# EAGLE design mainboard (EAGLE 5.07)

## Sheet 1 of 3
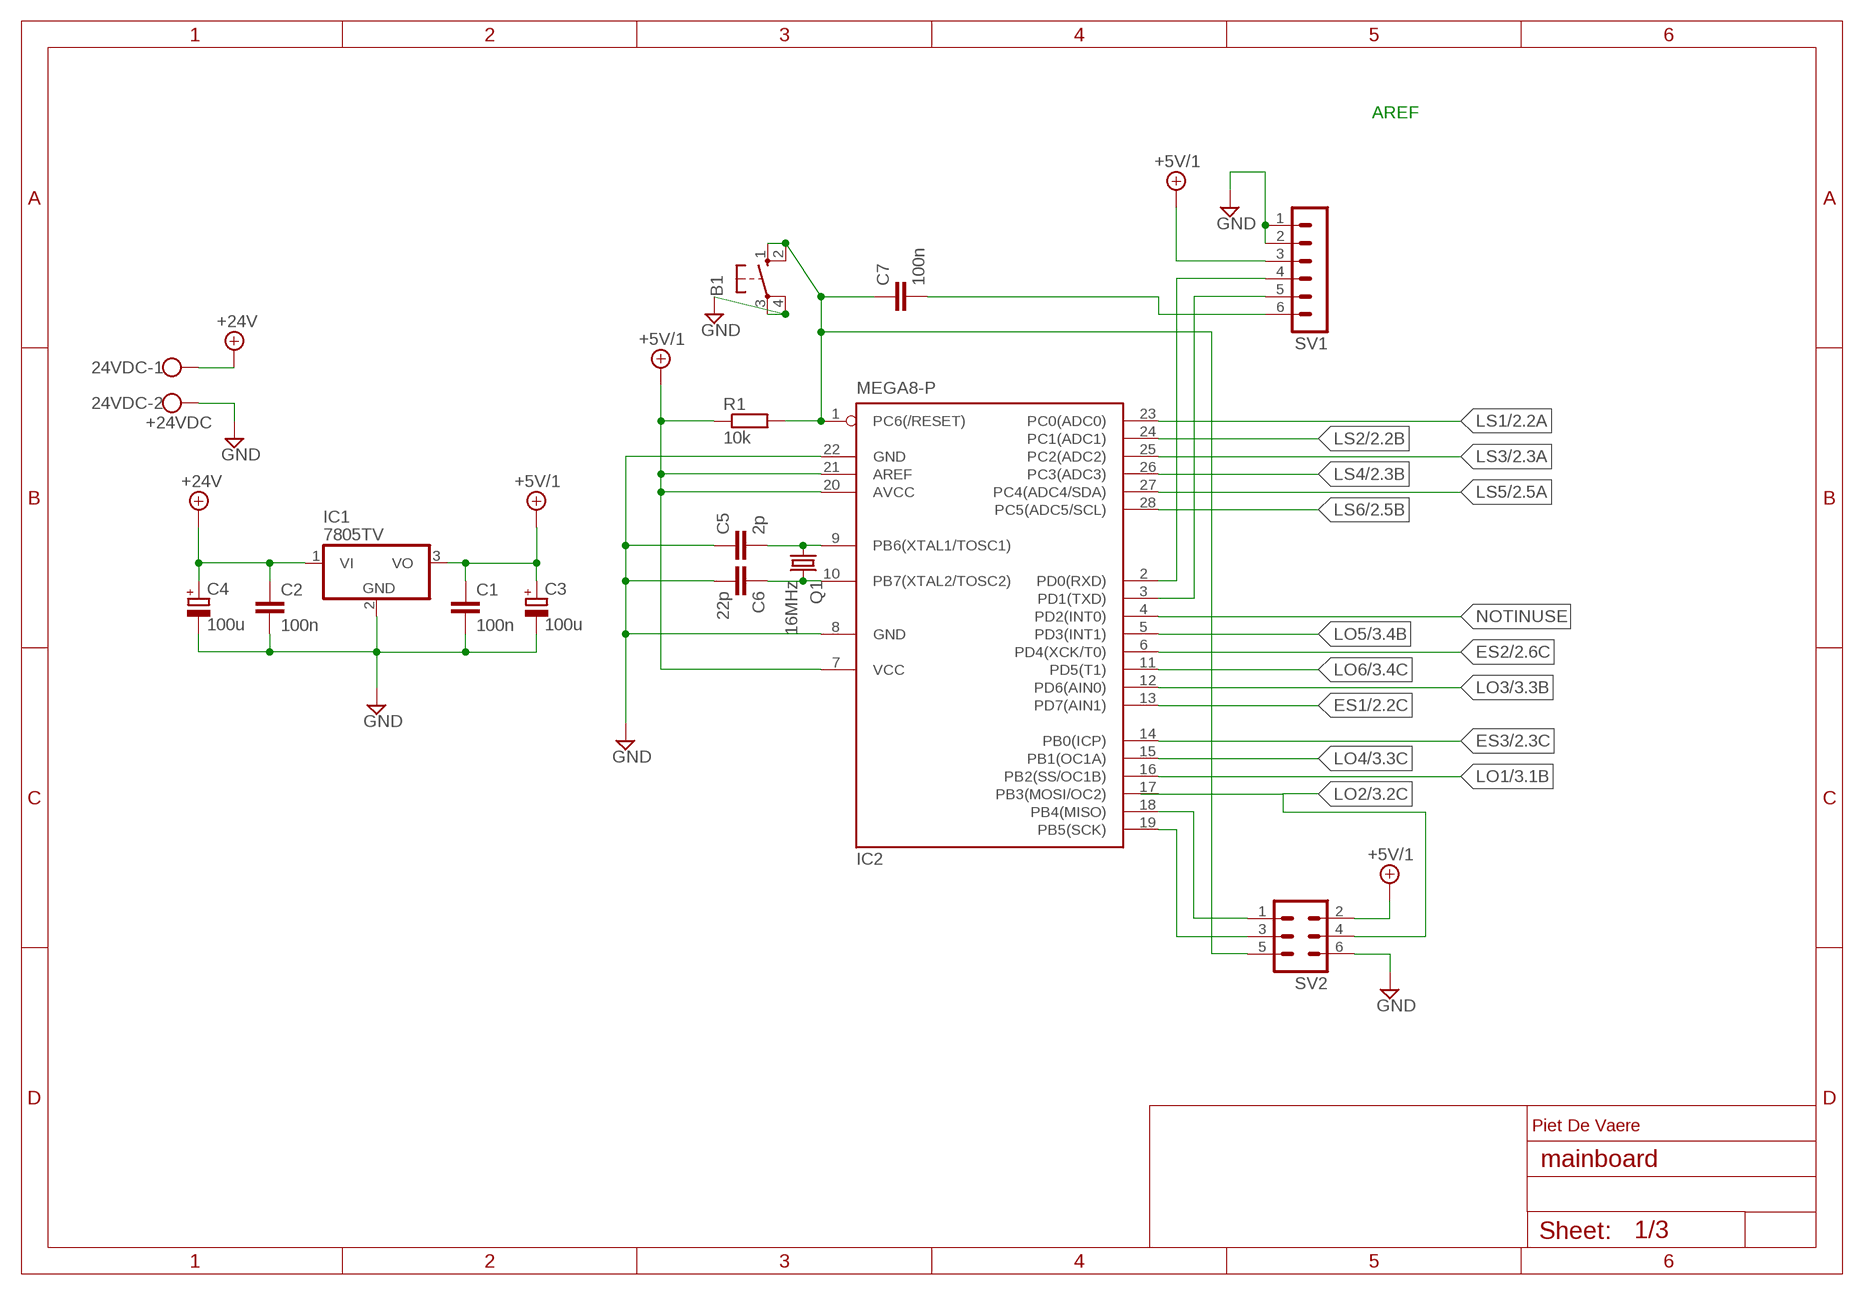
[diagram p0: schematic, sheet 1]

### Parts
24VDC  +24VDC  W237-02P  [W237-132]
B1  10-XX  [B3F-10XX]
C1  100n  C-EU025-030X050  [C025-030X050]
C2  100n  C-EU025-030X050  [C025-030X050]
C3  100u  CPOL-EUE3.5-8  [E3,5-8]
C4  100u  CPOL-EUE3.5-8  [E3,5-8]
C5  2p  C-EU025-030X050  [C025-030X050]
C6  22p  C-EU025-030X050  [C025-030X050]
C7  100n  C-EU025-030X050  [C025-030X050]
IC1  7805TV  [TO220V]
IC2  MEGA8-P  [DIL28-3]
Q1  16MHz  CRYSTALHC49S  [HC49/S]
R1  10k  R-EU_0207/10  [0207/10]
SV1  MA06-1  [MA06-1]
SV2  MA03-2  [MA03-2]

### Nets
+5V/1: C1.1 C3.+ IC1.3(VO) IC2.7(VCC) IC2.20(AVCC) IC2.21(AREF) R1.1 SV1.3 SV2.2 ; also sheet 2
+24V: 24VDC.1 C2.1 C4.+ IC1.1(VI)
ES1: IC2.13(PD7(AIN1)) ; also sheet 2
ES2: IC2.6(PD4(XCK/T0)) ; also sheet 2
ES3: IC2.14(PB0(ICP)) ; also sheet 2
GND [HP]: 24VDC.2 B1.3(P) B1.4(P1) C1.2 C2.2 C3.- C4.- C5.1 C6.2 IC1.2(GND) IC2.8(GND) IC2.22(GND) SV1.1 SV1.2 SV2.6 ; also sheet 2,3
LO1: IC2.16(PB2(SS/OC1B)) ; also sheet 3
LO2: SV2.4 ; also sheet 3
LO3: IC2.12(PD6(AIN0)) ; also sheet 3
LO4: IC2.15(PB1(OC1A)) ; also sheet 3
LO5: IC2.5(PD3(INT1)) ; also sheet 3
LO6: IC2.11(PD5(T1)) ; also sheet 3
LS1: IC2.23(PC0(ADC0)) ; also sheet 2
LS2: IC2.24(PC1(ADC1)) ; also sheet 2
LS3: IC2.25(PC2(ADC2)) ; also sheet 2
LS4: IC2.26(PC3(ADC3)) ; also sheet 2
LS5: IC2.27(PC4(ADC4/SDA)) ; also sheet 2
LS6: IC2.28(PC5(ADC5/SCL)) ; also sheet 2
N$2: C6.1 IC2.10(PB7(XTAL2/TOSC2)) Q1.2
N$3: C5.2 IC2.9(PB6(XTAL1/TOSC1)) Q1.1
N$4: IC2.19(PB5(SCK)) SV2.3
N$5: IC2.18(PB4(MISO)) SV2.1
N$6: IC2.2(PD0(RXD)) SV1.4
N$7: IC2.3(PD1(TXD)) SV1.5
N$8: C7.2 SV1.6
NOTINUSE: IC2.4(PD2(INT0))
RESET: B1.1(S) B1.2(S1) C7.1 IC2.1(PC6(/RESET)) R1.2 SV2.5
Unconnected: IC2.17(PB3(MOSI/OC2))

### Notes on the sheet
- AREF
- Piet De Vaere

## Sheet 2 of 3
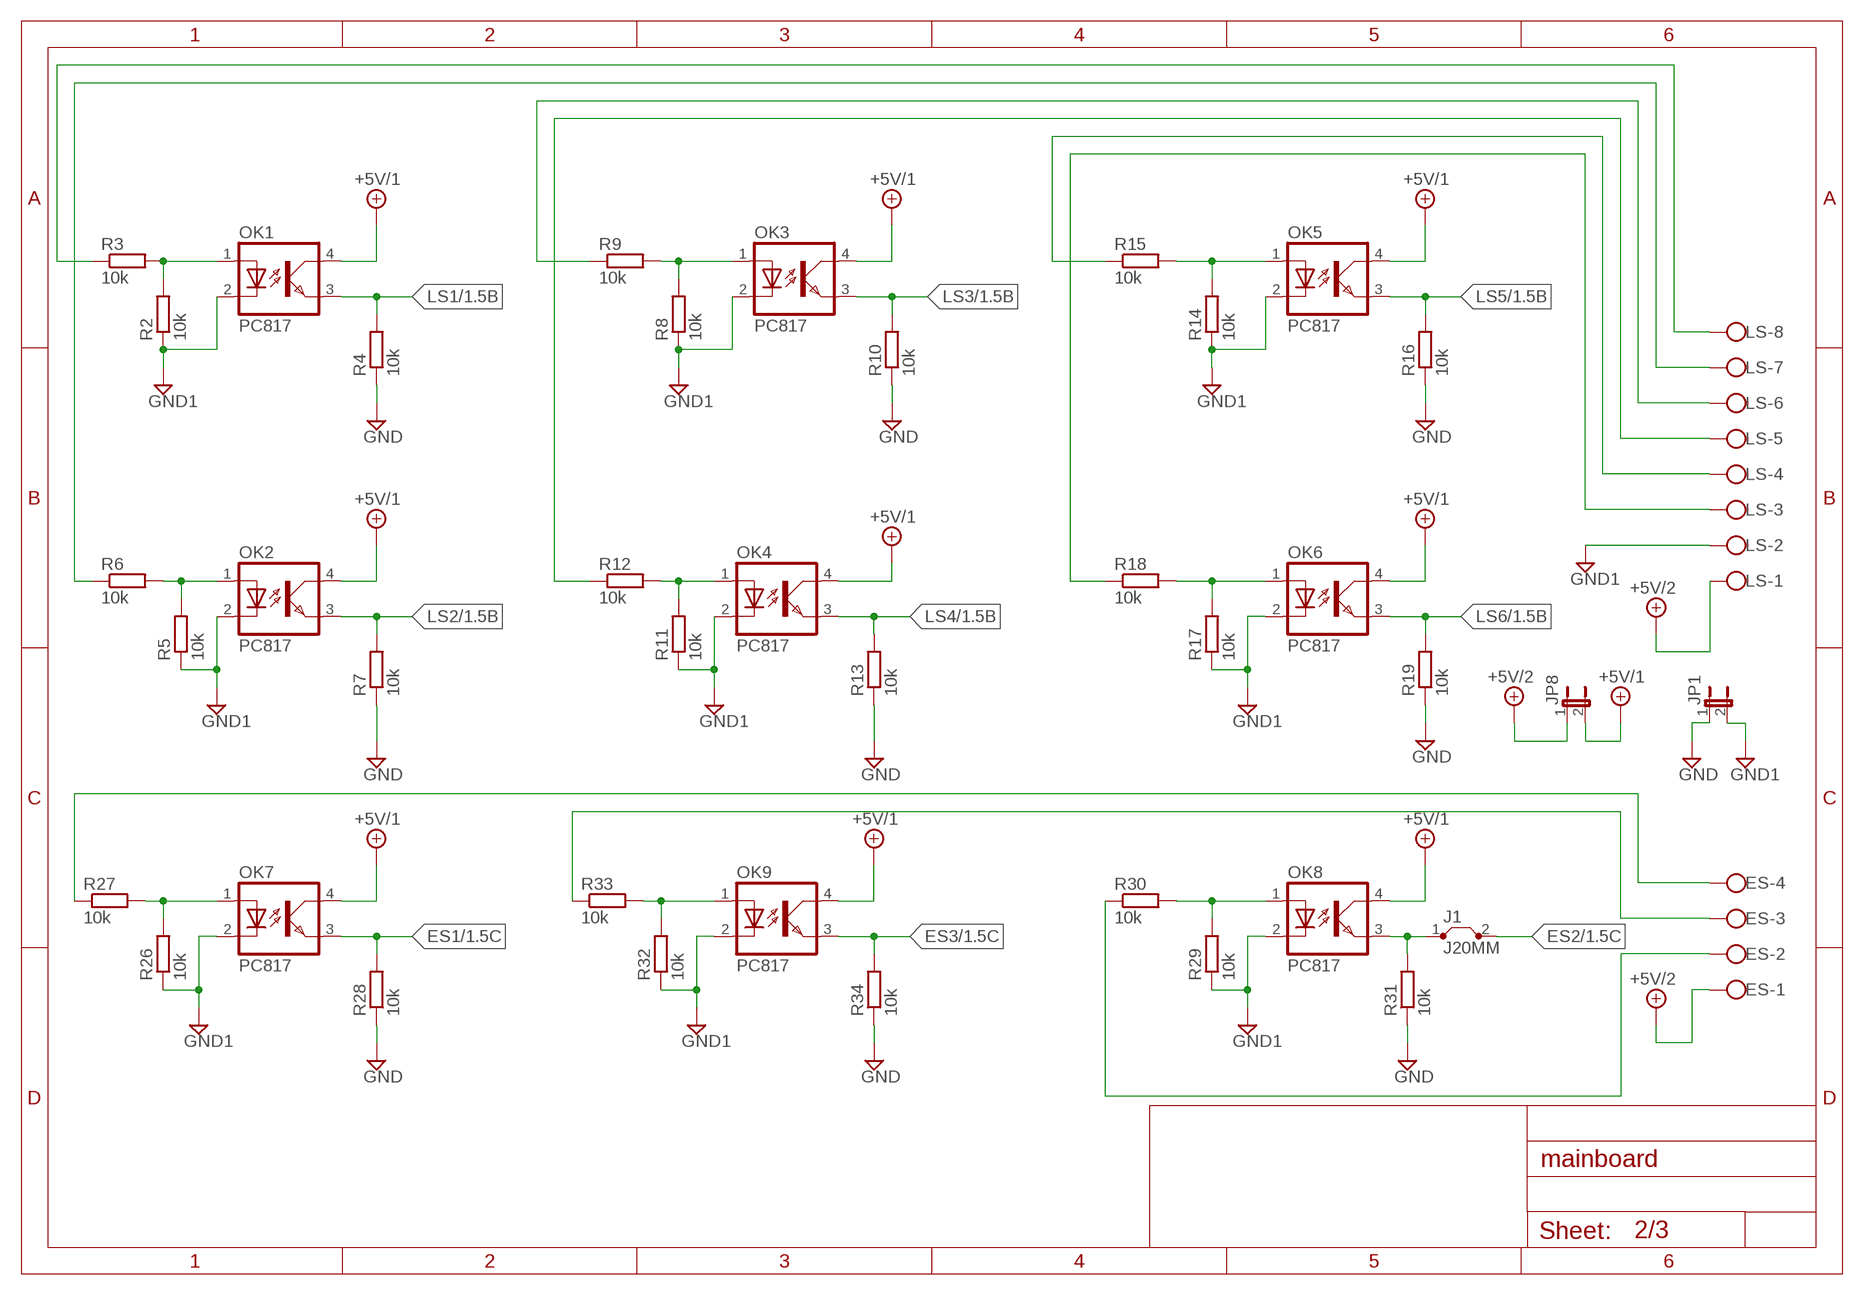
[diagram p1: schematic, sheet 2]

### Parts
ES  W237-04P  [W237-4P]
J1  J20MM  [20]
JP1  JP1E  [JP1]
JP8  JP1E  [JP1]
LS  W237-08P  [W237-8P]
OK1  PC817  [DIL04]
OK2  PC817  [DIL04]
OK3  PC817  [DIL04]
OK4  PC817  [DIL04]
OK5  PC817  [DIL04]
OK6  PC817  [DIL04]
OK7  PC817  [DIL04]
OK8  PC817  [DIL04]
OK9  PC817  [DIL04]
R2  10k  R-EU_0207/10  [0207/10]
R3  10k  R-EU_0207/10  [0207/10]
R4  10k  R-EU_0207/10  [0207/10]
R5  10k  R-EU_0207/10  [0207/10]
R6  10k  R-EU_0207/10  [0207/10]
R7  10k  R-EU_0207/10  [0207/10]
R8  10k  R-EU_0207/10  [0207/10]
R9  10k  R-EU_0207/10  [0207/10]
R10  10k  R-EU_0207/10  [0207/10]
R11  10k  R-EU_0207/10  [0207/10]
R12  10k  R-EU_0207/10  [0207/10]
R13  10k  R-EU_0207/10  [0207/10]
R14  10k  R-EU_0207/10  [0207/10]
R15  10k  R-EU_0207/10  [0207/10]
R16  10k  R-EU_0207/10  [0207/10]
R17  10k  R-EU_0207/10  [0207/10]
R18  10k  R-EU_0207/10  [0207/10]
R19  10k  R-EU_0207/10  [0207/10]
R26  10k  R-EU_0207/10  [0207/10]
R27  10k  R-EU_0207/10  [0207/10]
R28  10k  R-EU_0207/10  [0207/10]
R29  10k  R-EU_0207/10  [0207/10]
R30  10k  R-EU_0207/10  [0207/10]
R31  10k  R-EU_0207/10  [0207/10]
R32  10k  R-EU_0207/10  [0207/10]
R33  10k  R-EU_0207/10  [0207/10]
R34  10k  R-EU_0207/10  [0207/10]

### Nets
+5V/1: JP8.2 OK1.4(COL) OK2.4(COL) OK3.4(COL) OK4.4(COL) OK5.4(COL) OK6.4(COL) OK7.4(COL) OK8.4(COL) OK9.4(COL) ; also sheet 1
+5V/2: ES.1 JP8.1 LS.1
ES1: OK7.3(EMIT) R28.2 ; also sheet 1
ES2: J1.2 ; also sheet 1
ES3: OK9.3(EMIT) R34.2 ; also sheet 1
GND [HP]: JP1.1 R4.1 R7.1 R10.1 R13.1 R16.1 R19.1 R28.1 R31.1 R34.1 ; also sheet 1,3
GND1: JP1.2 LS.2 OK1.2(C) OK2.2(C) OK3.2(C) OK4.2(C) OK5.2(C) OK6.2(C) OK7.2(C) OK8.2(C) OK9.2(C) R2.1 R5.1 R8.1 R11.1 R14.1 R17.1 R26.1 R29.1 R32.1
LS1: OK1.3(EMIT) R4.2 ; also sheet 1
LS2: OK2.3(EMIT) R7.2 ; also sheet 1
LS3: OK3.3(EMIT) R10.2 ; also sheet 1
LS4: OK4.3(EMIT) ; also sheet 1
LS5: OK5.3(EMIT) R16.2 ; also sheet 1
LS6: OK6.3(EMIT) R19.2 ; also sheet 1
N$1: OK1.1(A) R2.2 R3.2
N$10: LS.8 R3.1
N$11: OK2.1(A) R5.2 R6.2
N$12: LS.7 R6.1
N$13: OK3.1(A) R8.2 R9.2
N$14: LS.6 R9.1
N$15: OK4.1(A) R11.2 R12.2
N$16: LS.5 R12.1
N$17: OK5.1(A) R14.2 R15.2
N$18: LS.4 R15.1
N$19: OK6.1(A) R17.2 R18.2
N$20: LS.3 R18.1
N$26: OK7.1(A) R26.2 R27.2
N$27: OK8.1(A) R29.2 R30.2
N$28: ES.4 R27.1
N$29: ES.3 R33.1
N$30: OK9.1(A) R32.2 R33.2
N$31: ES.2 R30.1
N$33: R13.2
N$49: J1.1 OK8.3(EMIT) R31.2

## Sheet 3 of 3
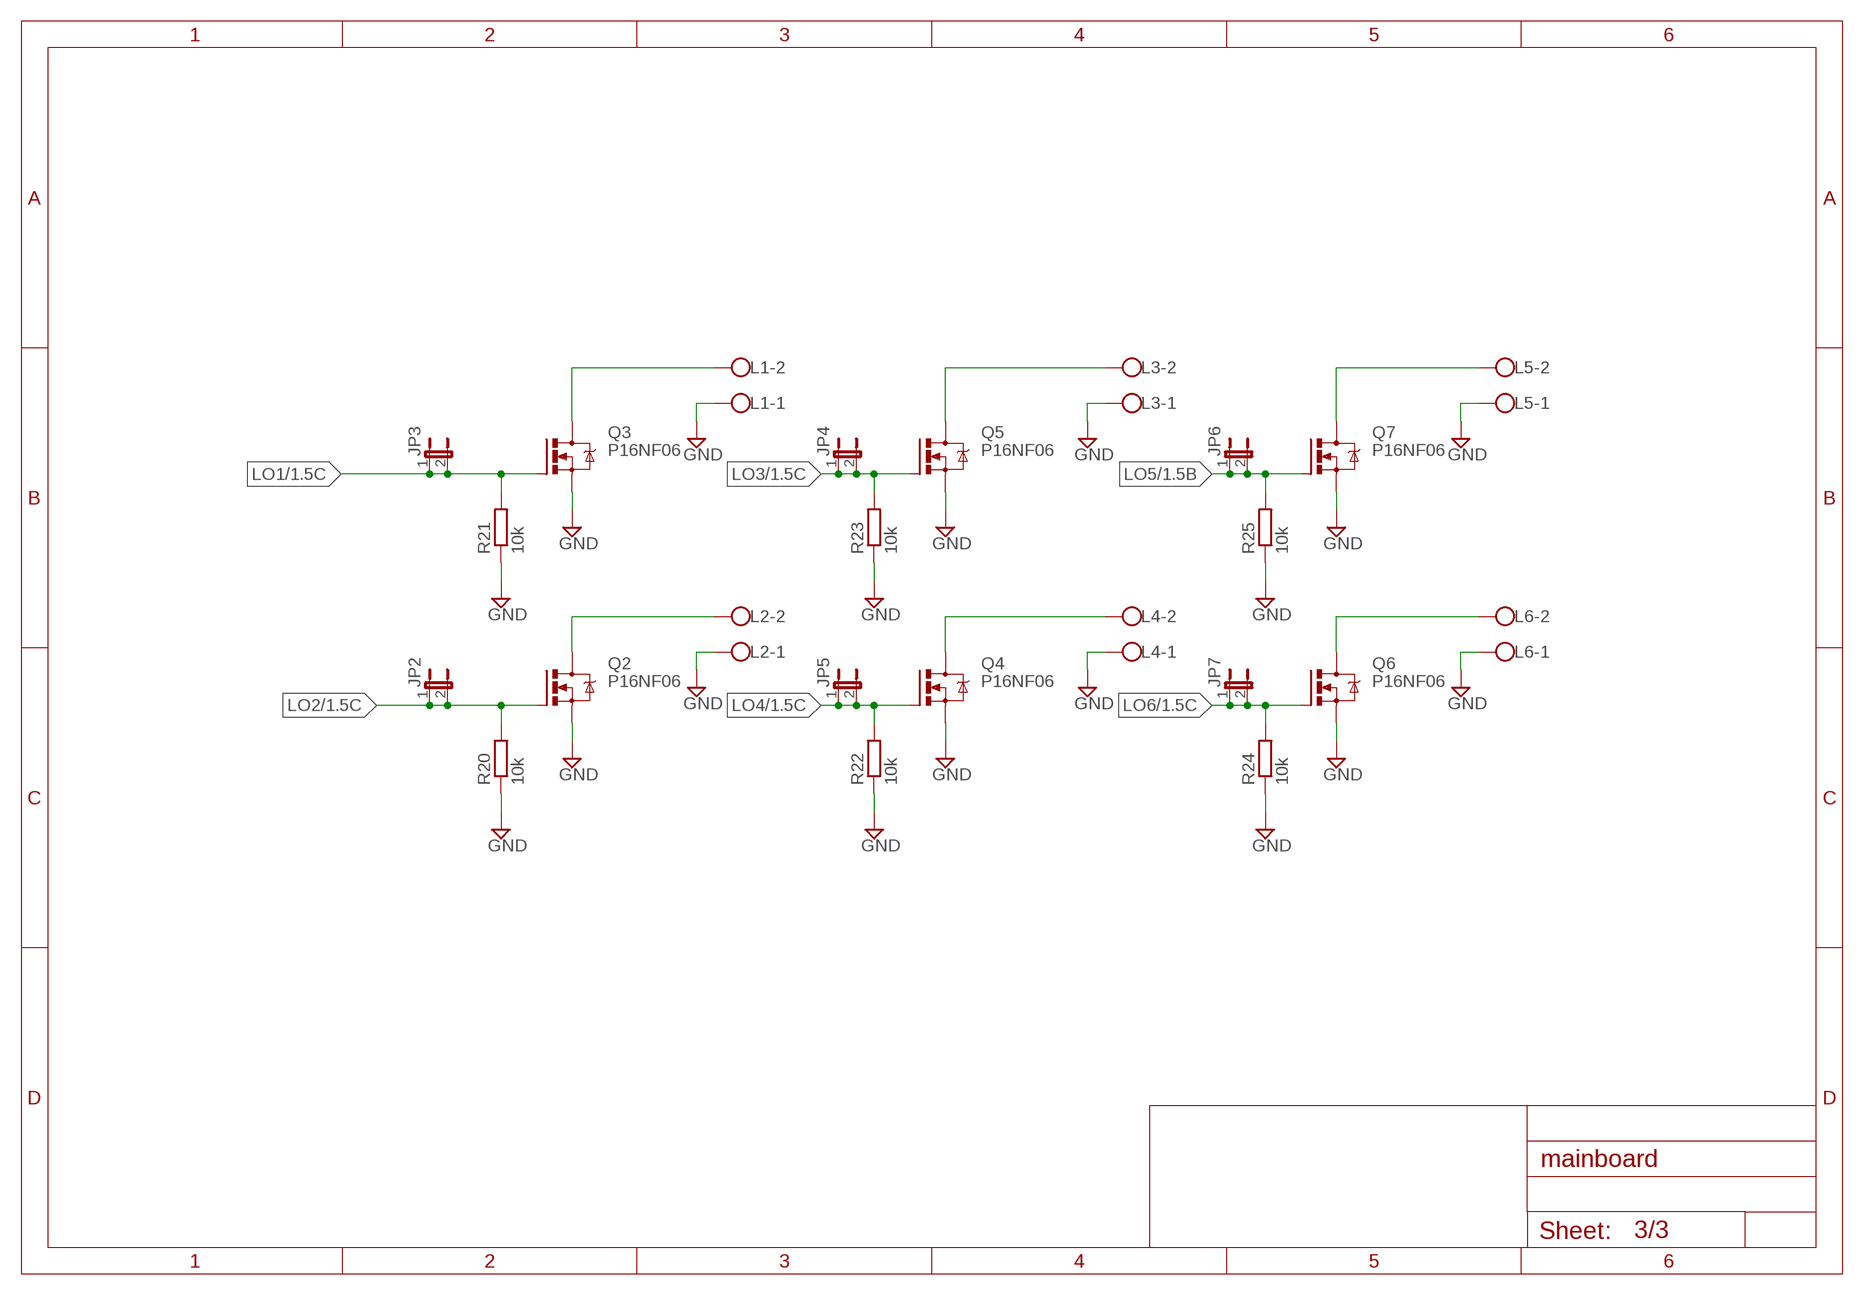
[diagram p2: schematic, sheet 3]

### Parts
JP2  JP1E  [JP1]
JP3  JP1E  [JP1]
JP4  JP1E  [JP1]
JP5  JP1E  [JP1]
JP6  JP1E  [JP1]
JP7  JP1E  [JP1]
L1  W237-02P  [W237-132]
L2  W237-02P  [W237-132]
L3  W237-02P  [W237-132]
L4  W237-02P  [W237-132]
L5  W237-02P  [W237-132]
L6  W237-02P  [W237-132]
Q2  P16NF06  IRF530  [TO220BV]
Q3  P16NF06  IRF530  [TO220BV]
Q4  P16NF06  IRF530  [TO220BV]
Q5  P16NF06  IRF530  [TO220BV]
Q6  P16NF06  IRF530  [TO220BV]
Q7  P16NF06  IRF530  [TO220BV]
R20  10k  R-EU_0207/7  [0207/7]
R21  10k  R-EU_0207/7  [0207/7]
R22  10k  R-EU_0207/7  [0207/7]
R23  10k  R-EU_0207/7  [0207/7]
R24  10k  R-EU_0207/7  [0207/7]
R25  10k  R-EU_0207/7  [0207/7]

### Nets
GND [HP]: L1.1 L2.1 L3.1 L4.1 L5.1 L6.1 Q2.S Q3.S Q4.S Q5.S Q6.S Q7.S R20.1 R21.1 R22.1 R23.1 R24.1 R25.1 ; also sheet 1,2
LO1: JP3.1 JP3.2 Q3.G R21.2 ; also sheet 1
LO2: JP2.1 JP2.2 Q2.G R20.2 ; also sheet 1
LO3: JP4.1 JP4.2 Q5.G R23.2 ; also sheet 1
LO4: JP5.1 JP5.2 Q4.G R22.2 ; also sheet 1
LO5: JP6.1 JP6.2 Q7.G R25.2 ; also sheet 1
LO6: JP7.1 JP7.2 Q6.G R24.2 ; also sheet 1
N$9 [HP]: L1.2 Q3.D
N$21 [HP]: L2.2 Q2.D
N$22 [HP]: L3.2 Q5.D
N$23 [HP]: L4.2 Q4.D
N$24 [HP]: L5.2 Q7.D
N$25 [HP]: L6.2 Q6.D

## Library data of the parts
24VDC L1-L6 = con-wago-508:W237-02P: WAGO SREW CLAMP
B1 = switch-omron:10-XX: OMRON SWITCH
C1 C2 C5-C7 = resistor:C-EU: CAPACITOR, European symbol
C3 C4 = resistor:CPOL-EU: POLARIZED CAPACITOR, European symbol
ES = con-wago-508:W237-04P: WAGO SREW CLAMP
IC1 = linear:78*: Positive VOLTAGE REGULATOR Source: http://cache.national.com/ds/LM/LM78L05.pdf http://www.fairchildsemi.com/ds/LM/LM7805.pdf
IC2 = atmel:MEGA8-P: MICROCONTROLLER 8 Kbytes FLASH, 1 kbytes SRAM, 512 bytes EEPROM, USART, 4-channel 10 bit ADC, 2-channel 8 bit ADC Pin compatible with Atmega48, ATMega88, ATMega168 Source: avr.lbr
J1 = jumper:J: Bridge
JP1-JP8 = jumper:JP1E: JUMPER
LS = con-wago-508:W237-08P: WAGO SREW CLAMP
OK1-OK9 = optocoupler:PC817: SHARP OPTO COUPLER
Q1 = crystal:CRYSTAL: CRYSTAL
Q2-Q7 = transistor-power:IRF530: HEXFET Power MOSFET
R1-R34 = resistor:R-EU_: RESISTOR, European symbol
SV1 = con-lstb:MA06-1: PIN HEADER
SV2 = con-lstb:MA03-2: PIN HEADER

## Board
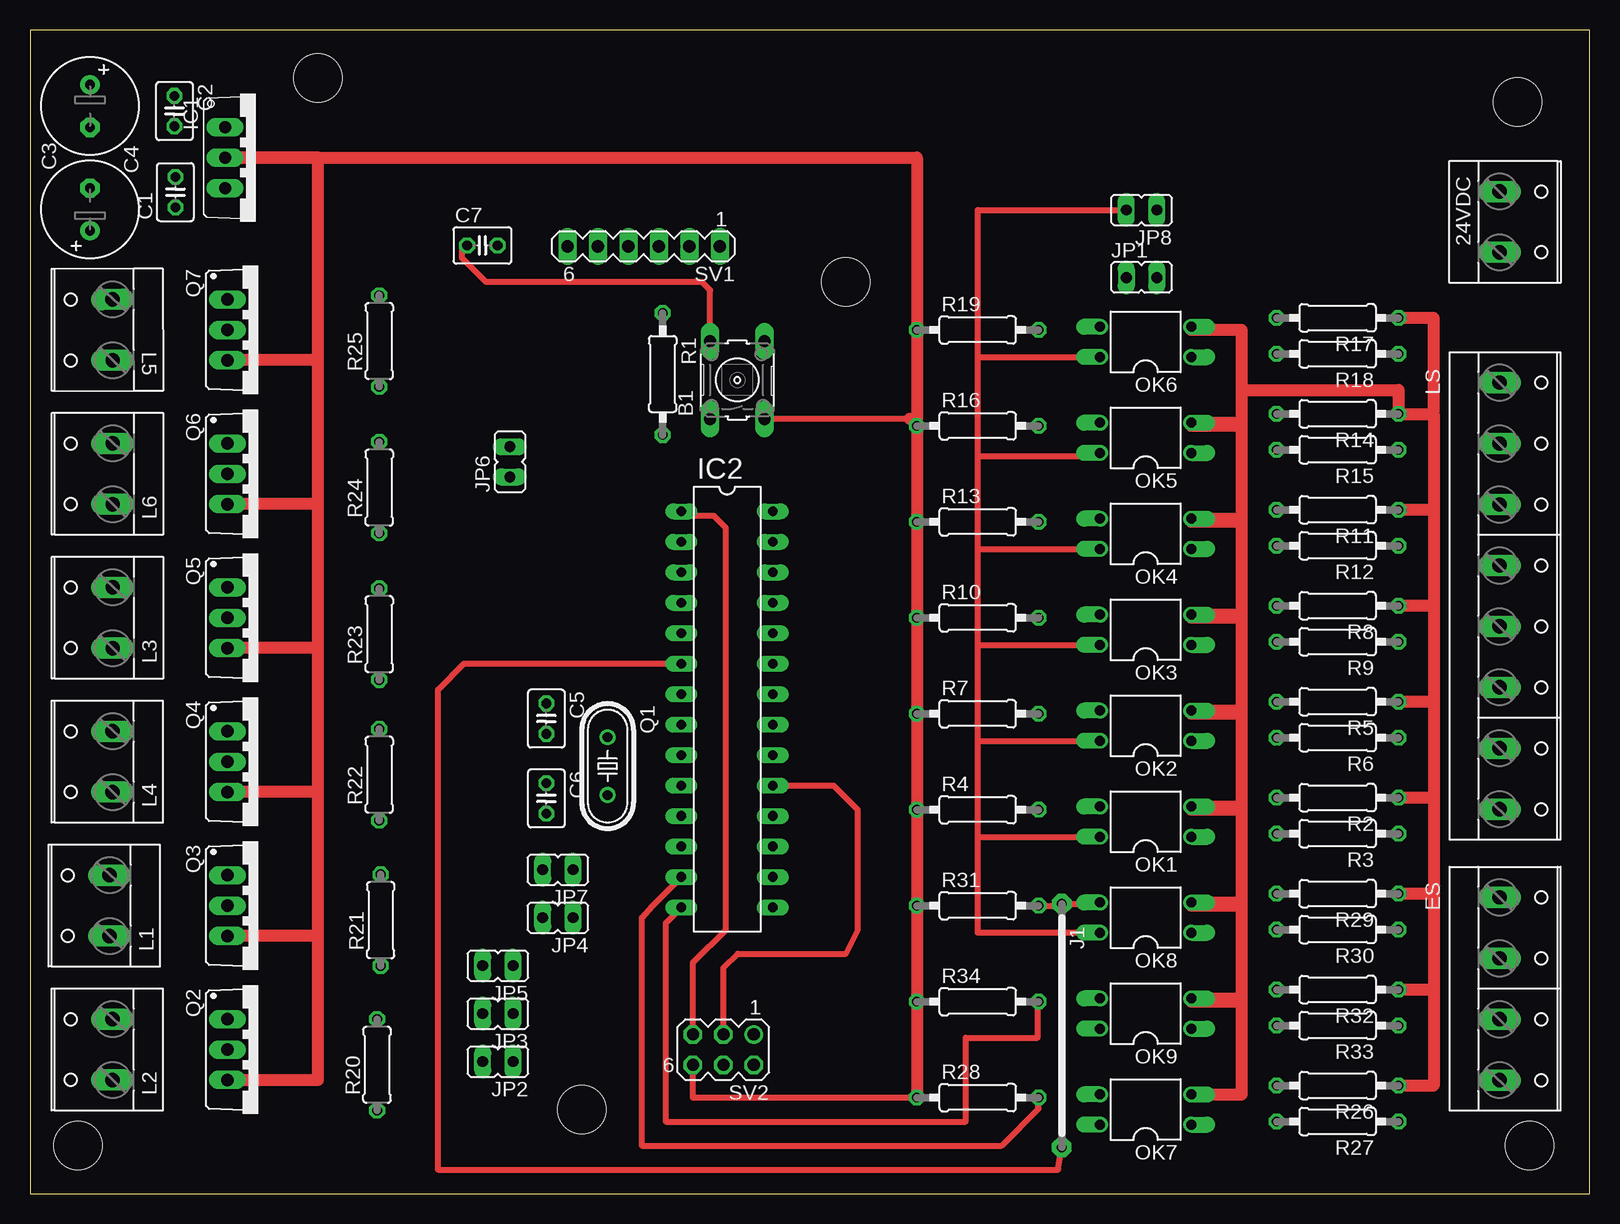
[diagram p3: board, top side]
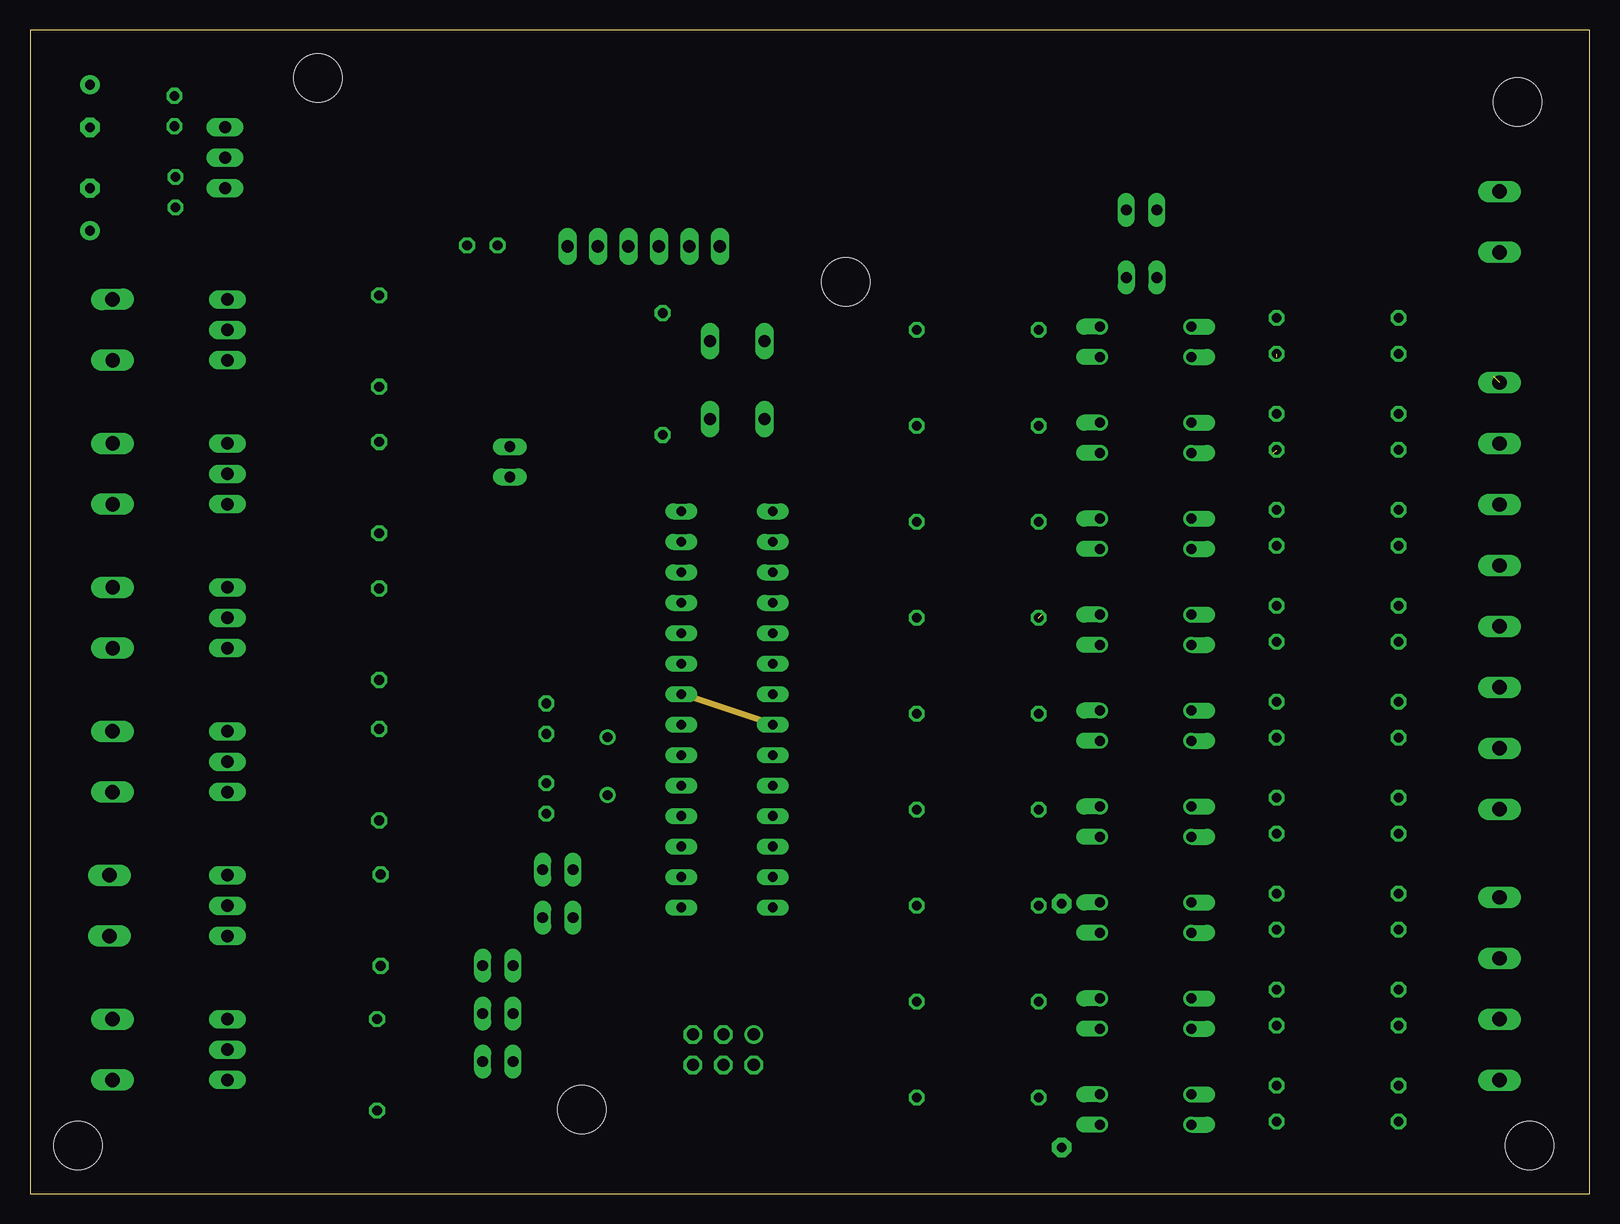
[diagram p4: board, inner layer Route2]
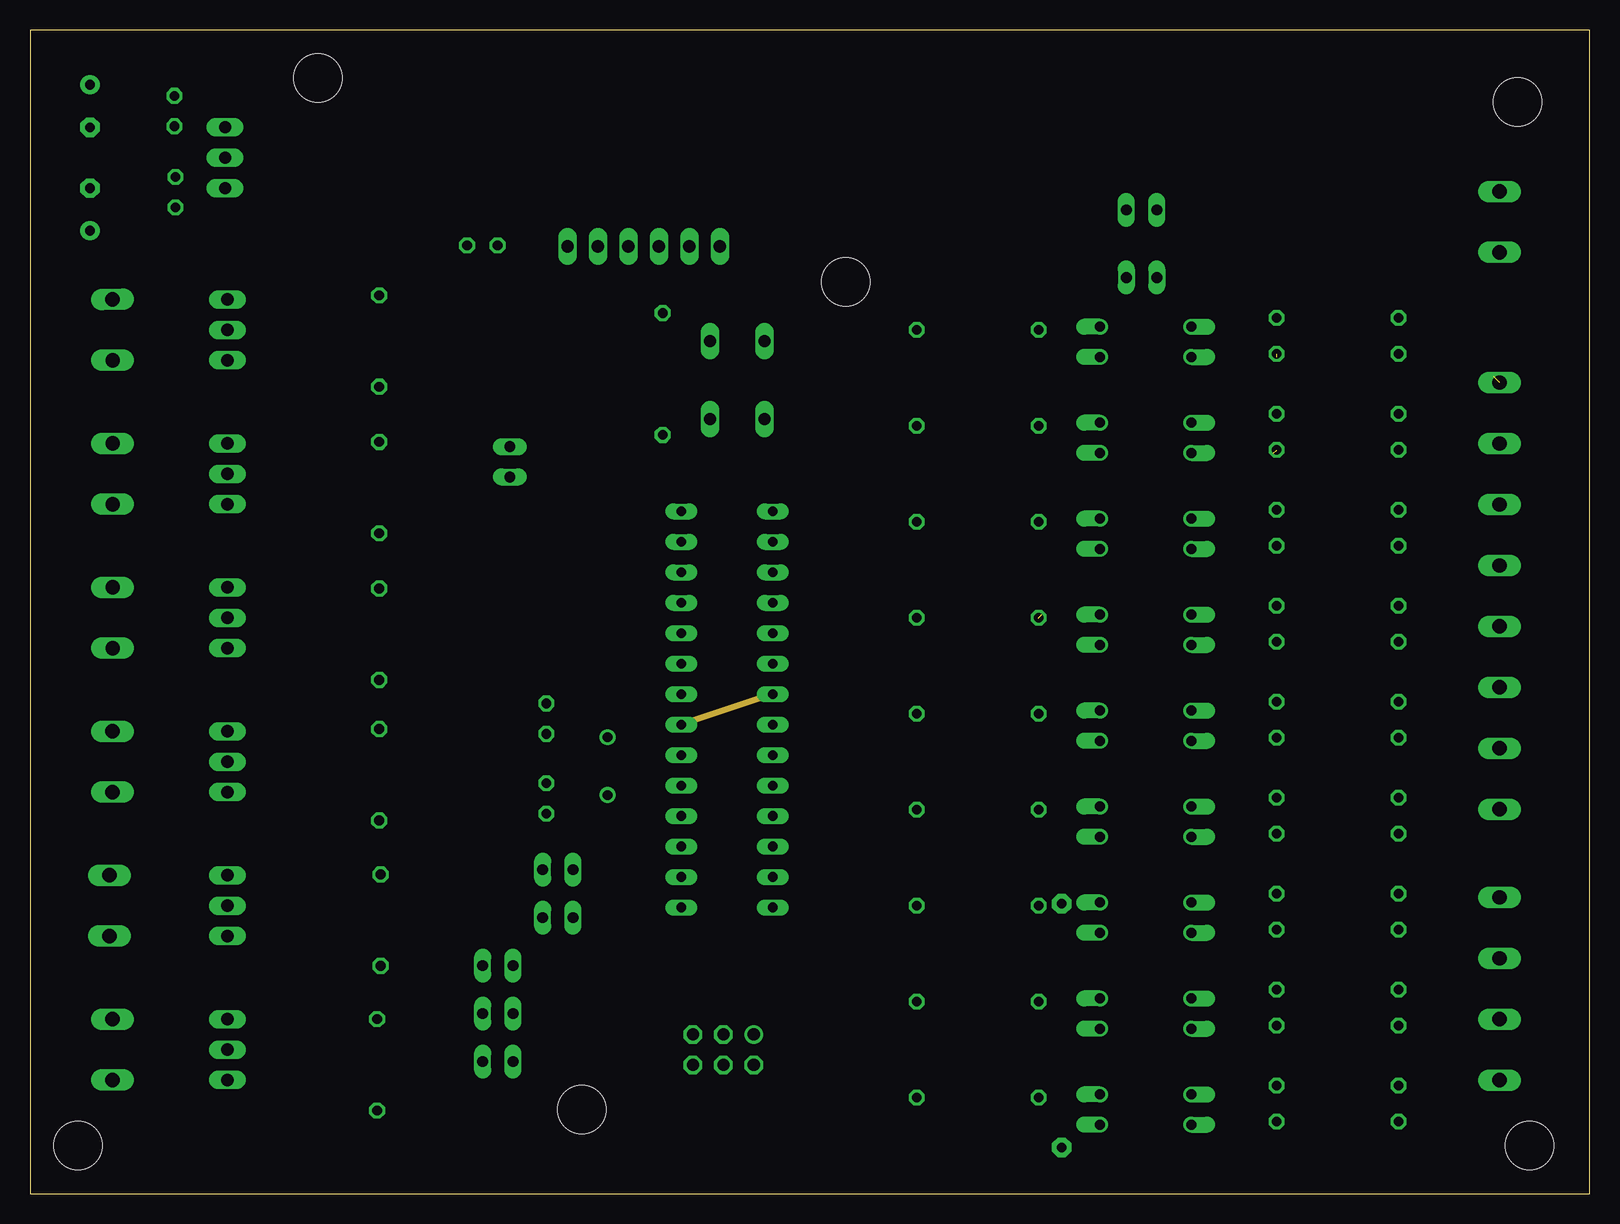
[diagram p5: board, inner layer Route3]
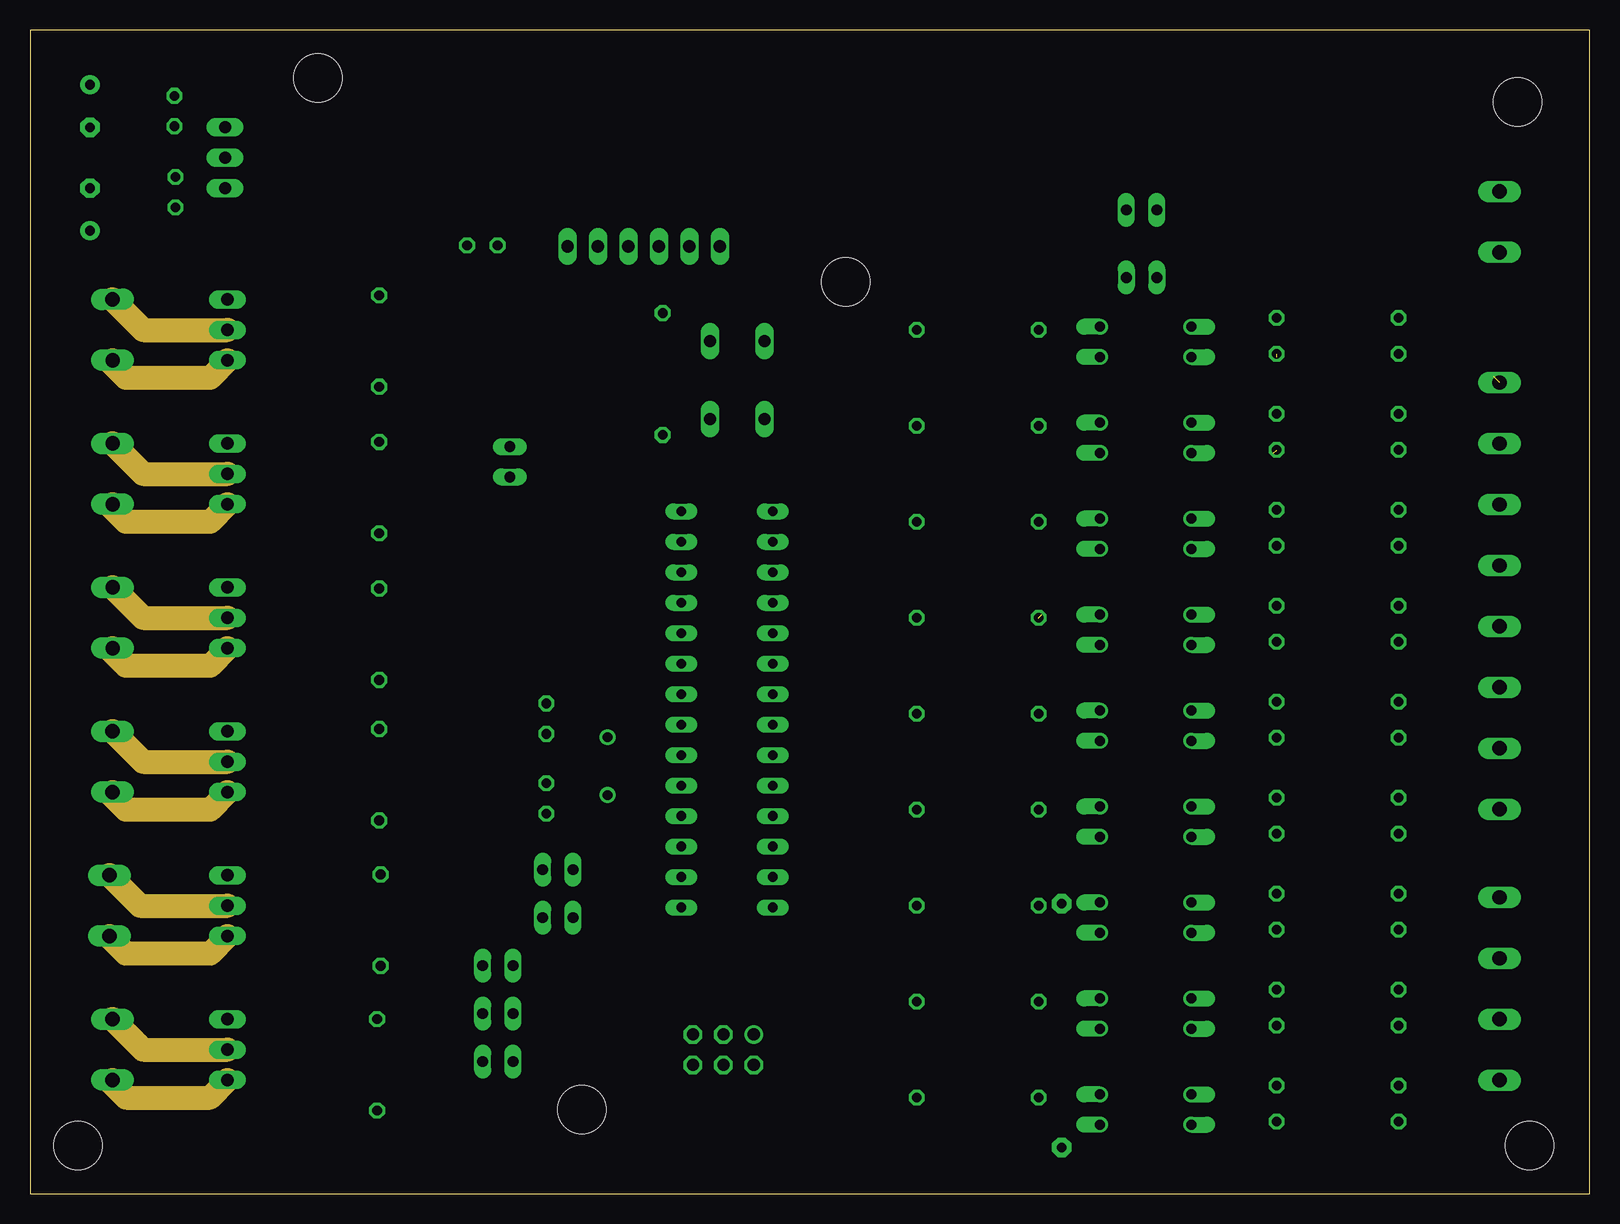
[diagram p6: board, inner layer Route4]
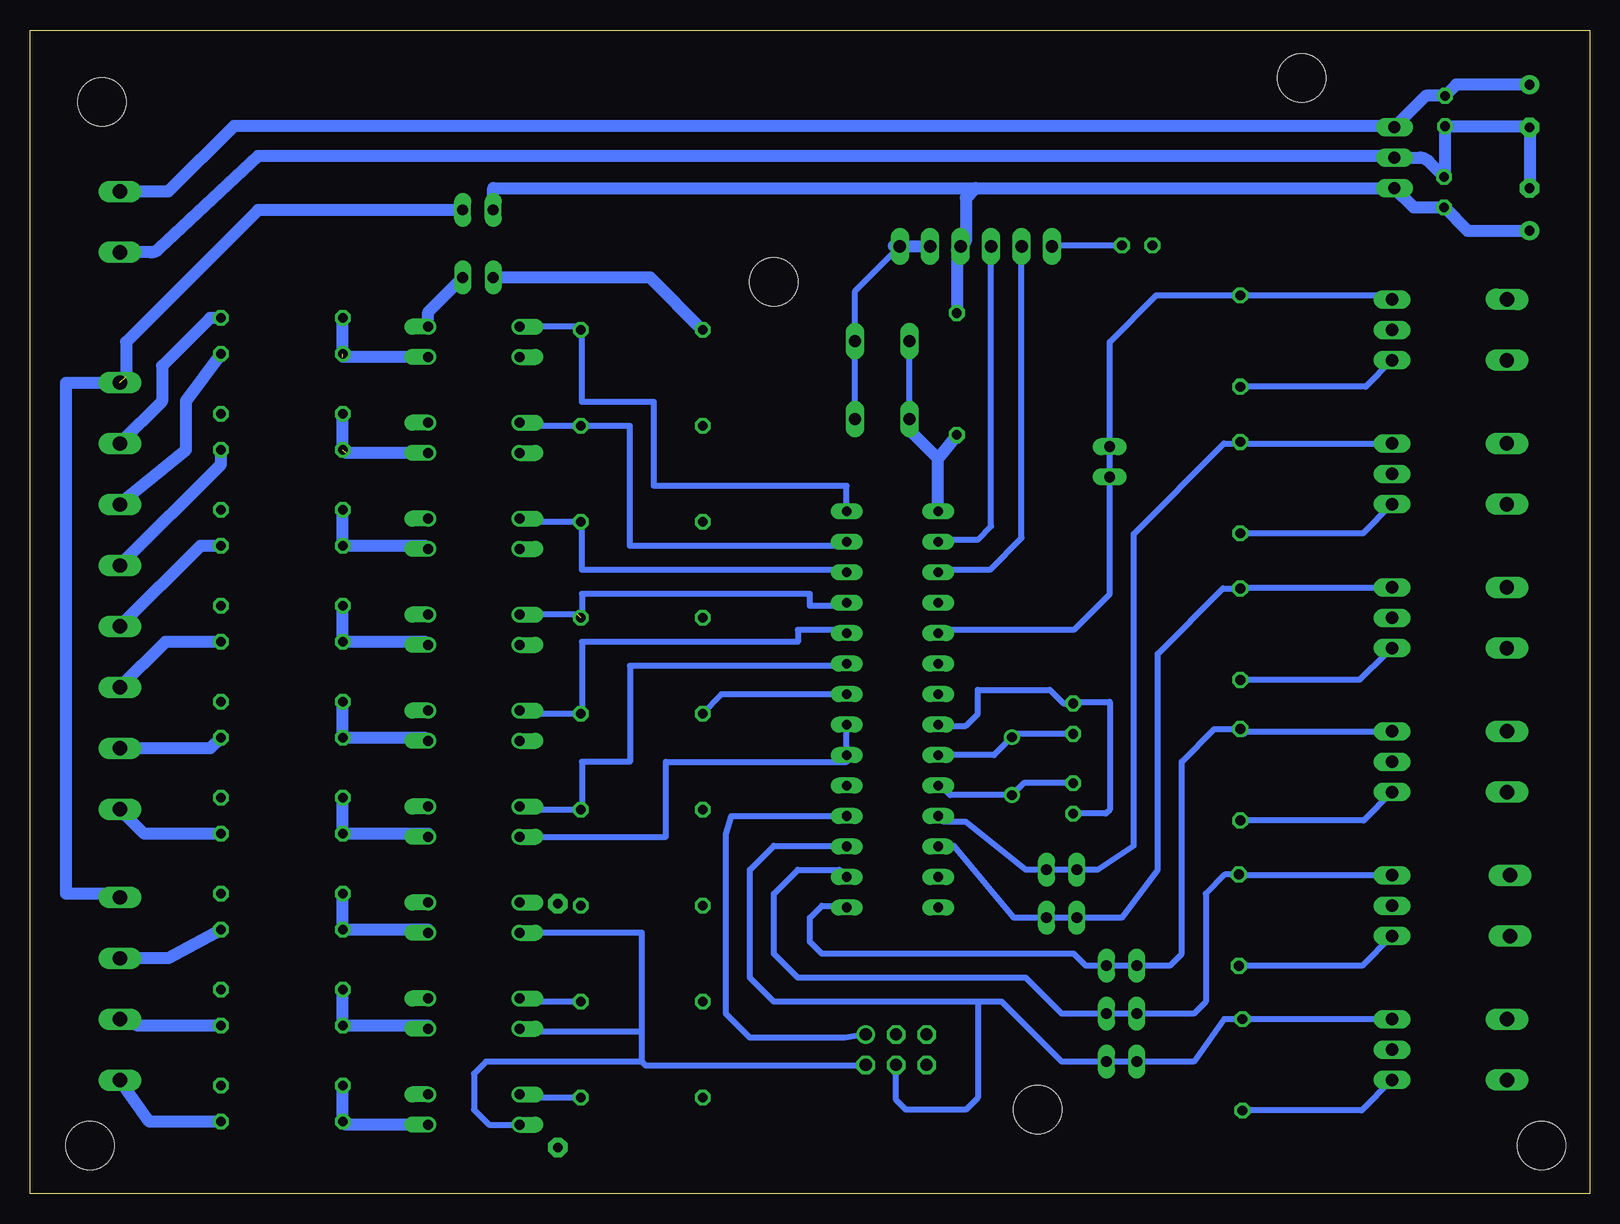
[diagram p7: board, bottom side, seen from below]

Size 130 x 97 mm. Coordinates in mm from the lower left corner, seen from the top.
Outline: 0,0 130,0 130,97 0,97 0,0
Copper layers (1*16): Top 0.035mm / dielectric 1.5mm / Bottom 0.035mm
Design rules "default": minimum track width 10mil, minimum drill 24mil, track to track 8mil, track to pad 8mil, pad to pad 8mil, via to via 8mil, smd to smd 8mil, copper to edge 40mil, drill to drill 8mil, minimum pad ring 10mil, minimum via ring 8mil, stop-mask expansion 4mil, vias tented up to drill 0mil, thermal gap 10mil
Holes 4 mm at 68,76 124,91 4,4 125,4 24,93 46,7

### Footprints (pad centres in the part's own frame; a part is rotated, then mirrored left to right if it is on the bottom)
W237-132 = drill 1.194 long: 1 -2.54,-0.635; 2 2.54,-0.635
B3F-10XX = drill 1.016 long: 1 -3.251,2.261; 2 3.251,2.261; 3 -3.251,-2.261; 4 3.251,-2.261
C025-030X050 = drill 0.813 octagon: 1 -1.27,0; 2 1.27,0
E3,5-8 = drill 0.813 pad 1.6 round: + -1.778,0 | drill 0.813 pad 1.6 octagon: - 1.778,0
W237-4P = drill 1.194 long: 1 -7.62,-0.635; 2 -2.54,-0.635; 3 2.54,-0.635; 4 7.62,-0.635
TO220V = drill 1.016 long: 1 -2.54,-2.54; 2 0,-2.54; 3 2.54,-2.54
DIL28-3 = drill 0.813 long: 1 -16.51,-3.81; 2 -13.97,-3.81; 3 -11.43,-3.81; 4 -8.89,-3.81; 5 -6.35,-3.81; 6 -3.81,-3.81; 7 -1.27,-3.81; 8 1.27,-3.81; 9 3.81,-3.81; 10 6.35,-3.81; 11 8.89,-3.81; 12 11.43,-3.81; 13 13.97,-3.81; 14 16.51,-3.81; 15 16.51,3.81; 16 13.97,3.81; 17 11.43,3.81; 18 8.89,3.81; 19 6.35,3.81; 20 3.81,3.81; 21 1.27,3.81; 22 -1.27,3.81; 23 -3.81,3.81; 24 -6.35,3.81; 25 -8.89,3.81; 26 -11.43,3.81; 27 -13.97,3.81; 28 -16.51,3.81
20 = drill 0.813 pad 1.6 octagon: 1 -10.16,0; 2 10.16,0
JP1 = drill 0.914 long: 1 0,-1.27; 2 0,1.27
W237-8P = drill 1.194 long: 1 -17.78,-0.635; 2 -12.7,-0.635; 3 -7.62,-0.635; 4 -2.54,-0.635; 5 2.54,-0.635; 6 7.62,-0.635; 7 12.7,-0.635; 8 17.78,-0.635
DIL04 = drill 0.813 offset: 1 -1.27,-3.81; 2 1.27,-3.81; 3 1.27,3.81; 4 -1.27,3.81
HC49/S = drill 0.813 round: 1 -2.413,0; 2 2.413,0
TO220BV = drill 1.016 long: D 0,-2.54; G -2.54,-2.54; S 2.54,-2.54
0207/10 = drill 0.813 octagon: 1 -5.08,0; 2 5.08,0
0207/7 = drill 0.813 octagon: 1 -3.81,0; 2 3.81,0
MA06-1 = drill 1.016 long: 1 -6.35,0; 2 -3.81,0; 3 -1.27,0; 4 1.27,0; 5 3.81,0; 6 6.35,0
MA03-2 = drill 1.016 round: 1 -2.54,-1.27 | drill 1.016 octagon: 2 -2.54,1.27; 3 0,-1.27; 4 0,1.27; 5 2.54,-1.27; 6 2.54,1.27

### Placement (x,y rotation side)
24VDC  123.14,81 270 top
B1  58.96,67.82 90 top
C1  12.12,83.48 90 top
C2  12.04,90.24 270 top
C3  5,82.04 90 top
C4  5,90.66 270 top
C5  43.04,39.59 270 top
C6  43.04,32.94 270 top
C7  37.71,79.04 0 top
ES  123.14,17.07 270 top
IC1  18.8,86.36 270 top
IC2  58.11,40.36 270 top
J1  86,14 270 top
JP1  92.66,76.36 270 top
JP2  39,11 90 top
JP3  39,15 90 top
JP4  44,23 90 top
JP5  39,19 90 top
JP6  40,61 0 top
JP7  44,27 90 top
JP8  92.66,82 90 top
L1  6,24 90 top
L2  6.25,12 90 top
L3  6.26,48 90 top
L4  6.25,36 90 top
L5  6.25,72 90.1 top
L6  6.26,60 90 top
LS  123.14,49.82 270 top
OK1  93,31 90 top
OK2  93,39 90 top
OK3  93,47 90 top
OK4  93,55 90 top
OK5  93,63 90 top
OK6  93,71 90 top
OK7  93,7 90 top
OK8  93,23 90 top
OK9  93,15 90 top
Q1  48.15,35.63 270 top
Q2  19,12 270 top
Q3  19,24 270 top
Q4  19,36 270 top
Q5  19,48 270 top
Q6  19,60 270 top
Q7  19,72 270 top
R1  52.74,68.32 270 top
R2  109,33 180 top
R3  109,30 180 top
R4  79,32 0 top
R5  109,41 180 top
R6  109,38 180 top
R7  79,40 0 top
R8  109,49 180 top
R9  109,46 180 top
R10  79,48 0 top
R11  109,57 180 top
R12  109,54 180 top
R13  79,56 0 top
R14  109,65 180 top
R15  109,62 180 top
R16  79,64 0 top
R17  109,73 180 top
R18  109,70 180 top
R19  79,72 0 top
R20  28.93,10.73 90 top
R21  29.23,22.79 90 top
R22  29.11,34.91 90 top
R23  29.11,46.63 90 top
R24  29.11,58.85 90 top
R25  29.11,71.07 90 top
R26  109,9 180 top
R27  109,6 180 top
R28  79,8 0 top
R29  109,25 180 top
R30  109,22 180 top
R31  79,24 0 top
R32  109,17 180 top
R33  109,14 180 top
R34  79,16 0 top
SV1  51.15,78.96 180 top
SV2  57.8,11.99 180 top

### Tracks (layer width: path | path; a pad name or v marks a point on that pad's centre or on a via)
+5V/1
  Top 0.5: 79,69.73 OK6.4 | 79,61.5 79,69.73 | 79,61.5 89.19,61.5 OK5.4 | 79,53.73 OK4.4 | 79,53.73 79,61.5 | 79,45.73 OK3.4 | 79,45.73 79,53.73 | 79,37.73 OK2.4 | 79,37.73 79,45.73 | 79,29.73 OK1.4 | 79,29.73 79,37.73 | OK8.4 79,21.73 79,29.73 | JP8.2 79,82 79,69.73
  Route2 0.5: IC2.21 IC2.7
  Bottom 0.5: IC2.21 IC2.20 61.92,36 77,36 77,29.73 OK1.4 | OK8.4 79,21.73 79,13.5 | 79,13.5 89.19,13.5 OK9.4 | 79,11 79,13.5 | 52.74,78.64 SV1.3 52,79.38 | SV2.2 60.34,10.66 78.66,10.66 79,11 | OK7.4 91.73,5.73 93,7 93,10 92,11 79,11
  Bottom 1: 52.74,78.64 R1.1 | C3.+ 10.17,80.26 C1.1 14.65,82.21 IC1.3 51.18,83.82 | 51.18,83.82 52,83 52,79.38 | JP8.2 91.39,83.82 51.18,83.82
+5V/2  (1 unrouted)
  Bottom 1: JP8.1 111,82 122,71 122,68.11 | LS.1 127,67.6 127,25 122.5,25 ES.1
+24V
  Bottom 1: C4.+ 11.11,92.44 C2.1 13.65,91.51 IC1.1 16.36,89 113,89 118.46,83.54 24VDC.1
ES1
  Top 0.5: R28.2 84.08,7.08 81,4 51,4 51,23 51.91,24 IC2.13
  Bottom 0.508: R28.2 88.92,8 OK7.3
ES2
  Top 0.5: J1.2 85.7,2 34,2 34,42 36.17,44.17 IC2.6
ES3
  Top 0.5: R34.2 84,16 84,13 78,13 78,6 53,6 53,22.55 IC2.14
  Bottom 0.508: R34.2 88.92,16 OK9.3
GND
  Top 0.5: R28.1 55.26,8 SV2.6 | R16.1 73.35,64.57 B1.3
  Top 1: R16.1 R13.1 R10.1 R7.1 R4.1 R31.1 R34.1 R28.1 | 73.35,64.57 73.92,64.57 R19.1 73.92,86.36 IC1.2 24,86.36 24,69.5 | Q2.S 24,9.46 24,21.46 | 24,21.46 24,33.46 | 24,57.46 24,69.5 | 24,21.46 Q3.S | 24,33.46 Q4.S | 24,45.46 Q5.S | 24,33.46 24,45.46 | 24,57.46 Q6.S | 24,45.46 24,57.46 | 24,69.5 16.5,69.5 Q7.S
  Route3 0.5: IC2.22 IC2.8
  Route4 2: L2.1 6.88,9.12 8,8 15,8 Q2.S | L1.1 6.63,21.36 8,20 15,20 Q3.S | L4.1 6.88,33.12 8,32 15,32 Q4.S | L3.1 6.89,45.1 8,44 15,44 Q5.S | L6.1 6.89,57.1 8,56 15,56 Q6.S | L5.1 6.89,69.11 8,68 15,68 Q7.S
  Bottom 0.5: R23.1 19.18,42.82 17,45 16.92,45 Q5.S | R24.1 18.88,55.04 Q6.S | IC2.8 54.21,39 52,39 51,40 51,42 45,42 43.86,40.86 C5.1 42.9,41 40,41 40,32 40.33,31.67 C6.2 | B1.3 B1.4 61.22,75.24 SV1.1 | R20.1 19,6.92 Q2.S | R21.1 18.94,18.98 Q3.S | R25.1 18.66,67.26 Q7.S | R22.1 18.82,31.1 Q4.S
  Bottom 0.508: R7.1 74,40 72.37,41.63 IC2.22
  Bottom 1: C3.- C4.- 5.09,88.97 C2.2 12.04,84.94 arc45 C1.2 13.44,86.07 arc-45 14.14,86.36 IC1.2 arc-45 16.6,86.5 111,86.5 119.25,78.75 arc45 119.95,78.46 24VDC.2 | SV1.1 57.96,78.96 58,79 55,79 SV1.2 | JP1.1 78.28,76.36 R19.1
GND1
  Top 1.016: OK7.2 101,8.27 101,16 96.81,16 OK9.2 101,16.27 101,24 96.81,24 OK8.2 101,24.27 101,32 96.81,32 OK1.2 101,32.27 101,40 96.81,40 OK2.2 101,40.27 101,48 96.81,48 OK3.2 101,48.27 101,56 96.81,56 OK4.2 101,56.27 101,64 96.81,64 OK5.2 101,64.27 101,67 | 101,67 101,72 96.81,72 OK6.2 | R26.1 117,9 117,17 | 117,17 R32.1 | 117,25 117,17 | 117,25 R29.1 | 117,33 117,25 | 117,33 R2.1 | 117,41 117,33 | 117,41 R5.1 | 117,49 117,41 | 117,49 R8.1 | 117,57 117,49 | 117,57 R11.1 | 117,65 117,57 | 117,65 R14.1 114.08,67 101,67 | 117,65 117,73 R17.1
  Bottom 1: OK6.2 96.81,73.48 JP1.2 | LS.2 119,66.03 119,69 115,73 R17.1
LO1
  Bottom 0.5: Q3.G 29.17,26.54 | R21.2 30.4,26.6 32,25 32,16 33,15 JP3.2 JP3.1 44,15 47,18 66,18 68,20 68,25 66,27 62.53,27 IC2.16
  Bottom 1.016: 29.17,26.54 R21.2
LO2
  Bottom 0.5: Q2.G R20.2 30.46,14.54 33,11 JP2.2 JP2.1 44,11 49,16 51,16 | 51,16 68,16 70,18 70,27 68,29 62,29 | SV2.4 57.8,7.8 57,7 52,7 51,8 51,16
LO3
  Bottom 0.5: 29.01,50.54 Q5.G | R23.2 30.56,50.44 36,45 36,27 39,23 JP4.2 JP4.1 48,23 53,29 54.23,29 IC2.12
  Bottom 1.016: R23.2 29.01,50.54
LO4
  Bottom 0.5: 28.93,38.54 Q4.G | R22.2 31.28,38.72 34,36 34,20 35,19 JP5.2 JP5.1 42,19 43,20 64,20 65,21 65,23 64,24 62.07,24 IC2.15
  Bottom 1.016: R22.2 28.93,38.54
LO5
  Bottom 0.5: Q7.G 16.8,74.88 R25.2 36.12,74.88 40,71 JP6.2 JP6.1 40,50 43,47 54.01,47 IC2.5
LO6
  Bottom 0.5: Q6.G 28.99,62.54 30.46,62.54 38,55 38,29 41,27 JP7.2 JP7.1 47,27 52,31 53.83,31 IC2.11
  Bottom 1.016: 28.99,62.54 R24.2
LS1
  Bottom 0.508: OK1.3 88.92,32 R4.2 84,32 84,36 80,36 80,44 61.92,44 IC2.23
LS2
  Bottom 0.508: OK2.3 88.92,40 R7.2 84,40 84,46 66,46 66,47 61.92,47 IC2.24
LS3  (1 unrouted)
  Bottom 0.508: 84.35,48.27 OK3.3 | R10.2 84,48 84,50 65,50 65,49 61.92,49 IC2.25
LS4
  Bottom 0.508: OK4.3 89.19,56.19 89,56 84,56 84,52 61.92,52 IC2.26
LS5
  Bottom 0.508: OK5.3 88.92,64 R16.2 80,64 80,54 61.92,54 IC2.27
LS6
  Bottom 0.508: OK6.3 84.35,72.27 R19.2 84,72 84,66 78,66 78,59 61.92,59 IC2.28
N$1
  Bottom 1.016: OK1.1 96.81,30 R3.2 R2.2
N$2
  Bottom 0.5: 54.3,34.21 53.31,33.22 Q1.2 47.16,34.21 C6.1
  Bottom 0.508: 54.3,34.21 IC2.10
N$3
  Bottom 0.5: IC2.9 49.64,36.55 Q1.1 47.87,38.32 C5.2
N$4
  Top 0.5: SV2.3 57.8,18.8 59,20 68,20 69,22 69,32 67,34 IC2.19
N$5
  Bottom 0.5: IC2.18 71.53,31.47 72,30 72,15 70,13 62.08,13 SV2.1
N$6
  Bottom 0.5: SV1.4 49.88,55.62 51,54.5 54.13,54.5 IC2.2
N$7
  Bottom 0.5: SV1.5 47.34,54.66 50,52 54.09,52 IC2.3
N$8
  Bottom 0.5: C7.2 44.72,79.04 SV1.6
N$9
  Route4 2: L1.2 9.18,24 Q3.D
N$10
  Bottom 1.016: LS.8 120.47,30 R3.1
N$11
  Bottom 1.016: R5.2 R6.2 97.08,38 OK2.1
N$12
  Bottom 1.016: LS.7 114.96,37.12 R6.1
N$13
  Bottom 1.016: OK3.1 97.08,46 R9.2 R8.2
N$14
  Bottom 1.016: LS.6 118.7,46 R9.1
N$15
  Bottom 1.016: OK4.1 97.08,54 R12.2 R11.2
N$16
  Bottom 1.016: LS.5 115.78,54 R12.1
N$17  (1 unrouted)
  Bottom 1.016: OK5.1 103.65,61.73 | R15.2 R14.2
N$18
  Bottom 1.016: LS.4 114.08,60.78 R15.1
N$19  (1 unrouted)
  Bottom 1.016: OK6.1 103.92,69.73 R17.2
N$20
  Bottom 1.016: LS.3 122.5,57.49 117,62 117,66.08 R18.1
N$21
  Route4 2: L2.2 9.43,12 Q2.D
N$22
  Route4 2: L3.2 9.44,48 Q5.D
N$23
  Route4 2: L4.2 9.43,36 Q4.D
N$24
  Route4 2: L5.2 9.42,72 Q7.D
N$25
  Route4 2: L6.2 9.44,60 Q6.D
N$26
  Bottom 1.016: OK7.1 103.65,5.73 R27.2 R26.2 104,9
N$27
  Bottom 1.016: 97.08,22 OK8.1 96.81,22 R30.2 R29.2
N$28
  Bottom 1.016: R27.1 120.06,6 ES.4
N$29
  Bottom 1.016: R33.1 121.03,14 ES.3
N$30
  Bottom 1.016: OK9.1 96.81,14 R33.2 R32.2
N$31
  Bottom 1.016: ES.2 118.47,19.61 R30.1
N$49
  Top 0.5: OK8.3 88.92,24 88.92,24.16 J1.1 86,24 R31.2
RESET
  Top 0.5: B1.2 56.7,75.3 56,76 38,76 36,78 36,78.6 C7.1 | SV2.5 55.26,19.26 58,22 58,55.5 57,56.5 54.67,56.5 IC2.1
  Bottom 0.5: 56.7,63.66 B1.1 B1.2
  Bottom 1: IC2.1 54.3,61.26 | 54.3,61.26 R1.2 | 54.3,61.26 56.7,63.66